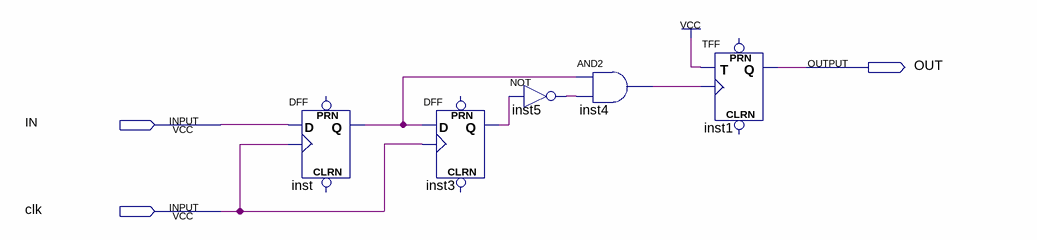
[diagram p0: schematic sheet]
// Quartus schematic debounce3.bdf as structural Verilog: 5 symbols, 3 pins
module debounce3 (
  input  IN,
  input  clk,
  output OUT
);

  wire inst3_q, inst4_out, inst5_out, inst_q;

  DFF inst (.CLK(clk), .D(IN), .Q(inst_q));  // open: CLRN, PRN
  DFF inst3 (.CLK(clk), .D(inst_q), .Q(inst3_q));  // open: CLRN, PRN
  not inst5 (inst5_out, inst3_q);
  and inst4 (inst4_out, inst_q, inst5_out);
  TFF inst1 (.T(1'b1), .CLK(inst4_out), .Q(OUT));  // open: PRN, CLRN
endmodule
